# Altium schematic sheet 02-SENSORS.SchDoc: SENSORS
size A4; DrawnBy: Trevor Charmley; Engineer: Trevor Charmley; Revision: 1
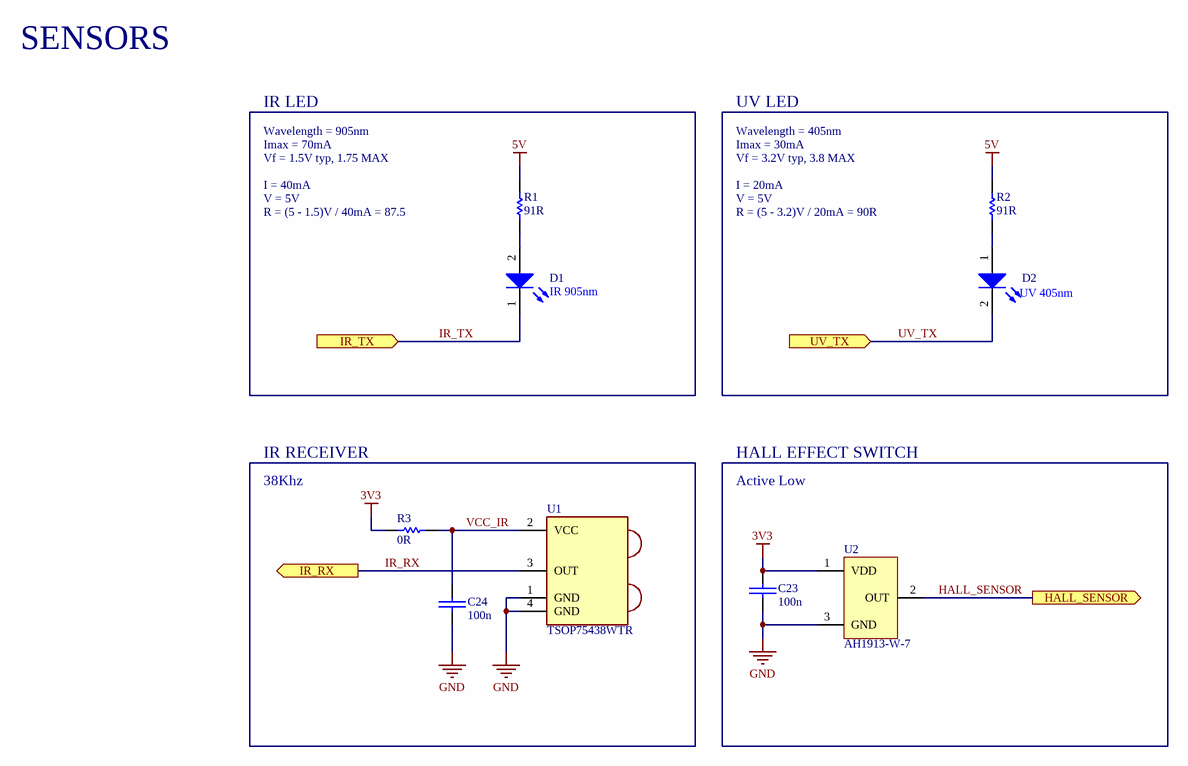
[diagram p0: 02-SENSORS.SchDoc]

## Parts
C23  100n  [CAPC100X50X65]
C24  100n  [CAPC100X50X65]
D1  value IR 905nm  [LED_SFH_4045N]  (hidden comment: LED)
D2  value UV 405nm  [LED_VLMU3100-GS08]  (hidden comment: LED)
R1  91R  [RESC0402]
R2  91R  [RESC0402]
R3  0R  [RESC0402]
U1  TSOP75438WTR  [TSOP75438WTR]
U2  AH1913-W-7  [SC59-3]

## Blocks framed on the sheet
IR LED: D1 R1
UV LED: D2 R2
IR RECEIVER: C24 R3 U1
HALL EFFECT SWITCH: C23 U2

## Ports
HALL_SENSOR (out), IR_RX (out), IR_TX (in), UV_TX (in)

## Nets
3V3: C23.1 R3.1 U2.1(VDD)
5V: R1.2 R2.2
GND: C23.2 C24.2 U1.1(GND) U1.4(GND) U2.3(GND)
HALL_SENSOR: U2.2(OUT) ; port HALL_SENSOR
IR_RX: U1.3(OUT) ; port IR_RX
IR_TX: D1.1 ; port IR_TX
UV_TX: D2.2(K) ; port UV_TX
VCC_IR: C24.1 R3.2 U1.2(VCC)
NetD1_2: D1.2 R1.1
NetD2_1: D2.1(A) R2.1

## Notes on the sheet
- SENSORS
- Imax = 70mA
- Wavelength = 905nm
- Imax = 30mA
- Wavelength = 405nm
- Vf = 1.5V typ, 1.75 MAX
- I = 40mA
- V = 5V
- R = (5 - 1.5)V / 40mA = 87.5
- Vf = 3.2V typ, 3.8 MAX
- I = 20mA
- R = (5 - 3.2)V / 20mA = 90R
- 38Khz
- Active Low
- Title
- Size:
- Date:
- A4
- Number:
- Revision:
- Sheet
- of
- FISHWAND
- File:
- Drawn By:

## Library data of the parts
C23 C24 = C_100NF_25V_X5R_0402: CAP CER 100nF 25V X5R 0402; Manufacturer: Murata Electronics; Manufacturer PN: GRM155R61E104KA87D; Supplier: Digi-Key; Supplier PN: 490-5920-2-ND
D1 = LED_SFH_4045N_IR_950nm: Infrared (IR) Emitter 950nm 1.6V 70mA 90mW/sr @ 70mA 18Â° 2-SMD, No Lead; Manufacturer PN: SFH 4045N; Manufacturer: OSRAM Opto; Purchase-URL: https://pricing.snapeda.com/search/part/SFH 4045N/?ref=eda; Package: SMT-2 OSRAM Opto; SnapEDA_Link: https://www.snapeda.com/parts/SFH%204045N/OSRAM%20Opto%20Semiconductors%20Inc./view-part/250024/?ref=snap; Check_prices: https://www.snapeda.com/parts/SFH%204045N/OSRAM%20Opto%20Semiconductors%20Inc./view-part/250024/?ref=eda; Digi-Key_Part_Number: 475-3047-1-ND
D2 = LED_VLMU3100-GS08_EMITTER_UV_405NM_30MA: Ultraviolet (UV) Emitter 405nm 3.2V 30mA 2.5mW/sr @ 20mA 120° 2-PLCC; Manufacturer: Vishay Semiconductor Opto Division; Package / Case: 2-PLCC; Manufacturer PN: VLMU3100-GS08; Price: None; Availability: Unavailable
R1 R2 = R_0402_90R_5%: 91 Ohms ±5% 0.063W, 1/16W Chip Resistor 0402 (1005 Metric) Moisture Resistant Thick Film; Manufacturer: YAGEO; Manufacturer PN: RC0402JR-0791RL; Supplier: Digi-Key; Supplier PN: 311-91JRCT-ND; Value: 91R; Tolerance: 5%; Package / Case: 0402
R3 = R_0402_0R_5%: 0 Ohms Jumper 0.063W, 1/16W Chip Resistor 0402 (1005 Metric) Thick Film; Manufacturer: YAGEO; Manufacturer PN: RC0402JR-070RP; Tolerance: 5%; Supplier: *; Supplier PN: *; Value: 0R; Package / Case: 0402
U1 = TSOP75438WTR_IR_38Khz_REMOTE: Remote Receiver Sensor 38.0kHz 45m Surface Mount; Manufacturer: Vishay Semiconductor Opto Division; Price: 2.08; Supplier PN: 751-TSOP75438WCT-ND; Manufacturer PN: TSOP75438WTR; Supplier: Digi-Key
U2 = U_MAG_SWITCH _AH1913-W-7: MAG SWITCH OMNIPOL SC59-3 T&R; Manufacturer: Diodes Incorporated; Manufacturer PN: AH1913-W-7; Supplier: Digi-Key; Supplier PN: SC-59-3; Package / Case: 0402